# Altium schematic sheet LMS.SchDoc
size A4; SheetNumber: 1; SheetTotal: 1
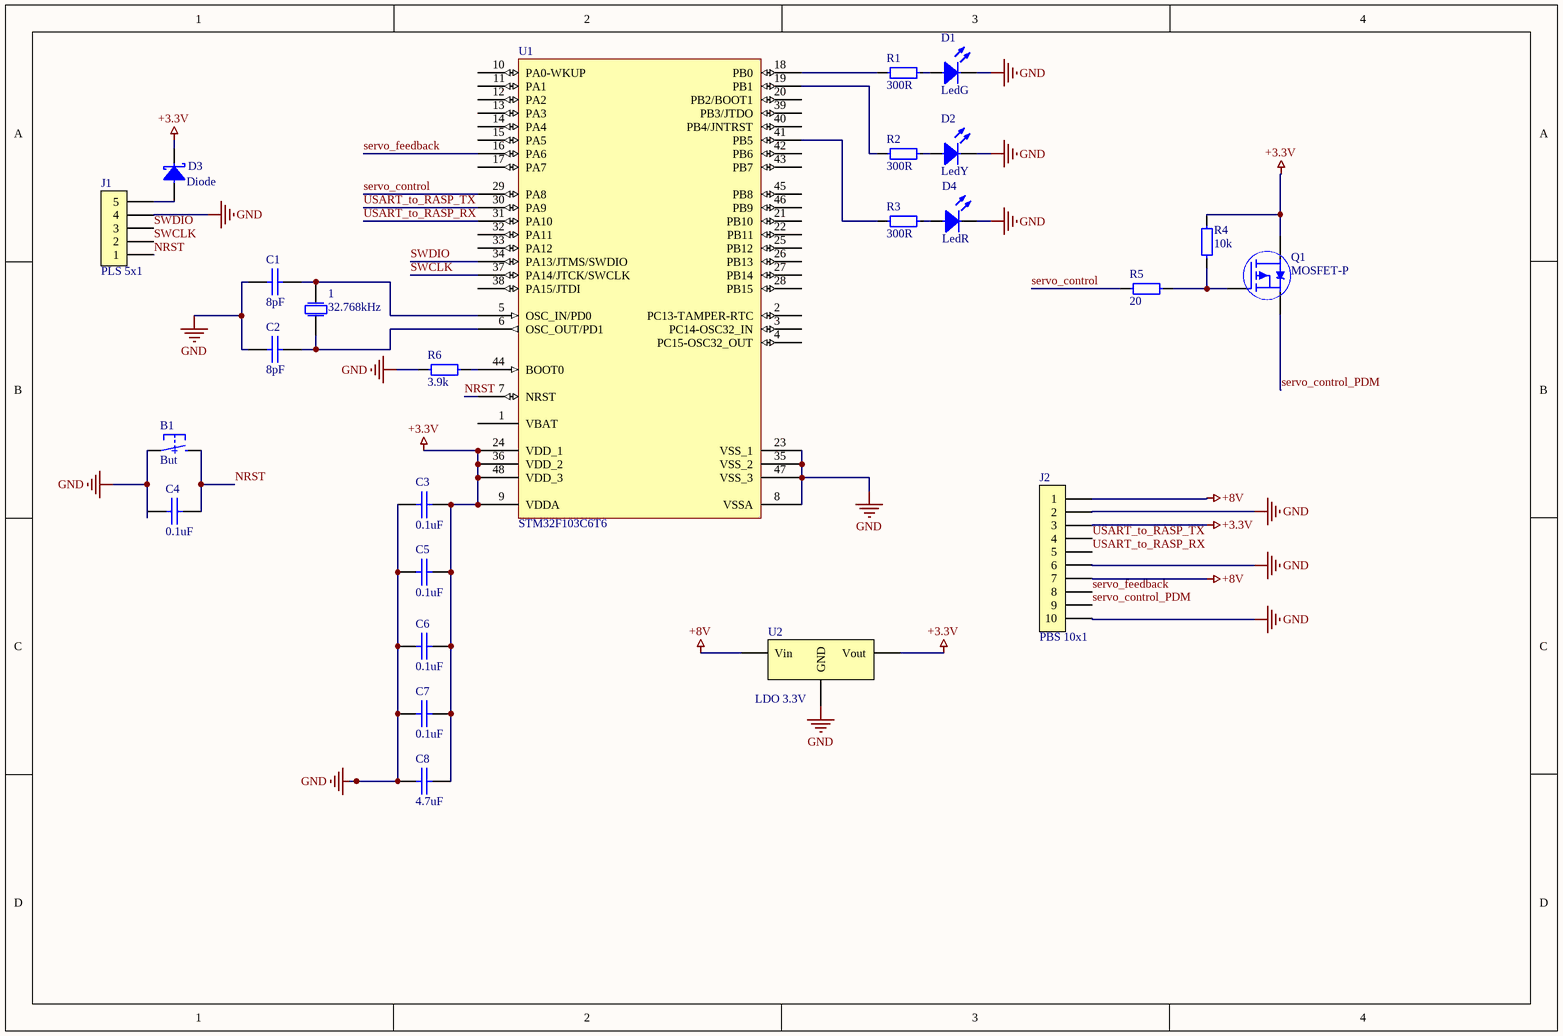
[diagram p0: LMS.SchDoc]

## Parts
1  32.768kHz  [Crystal ABM]
B1  But  [BUTTON 6x3.5]
C1  8pF  [0805 Capicator]
C2  8pF  [0805 Capicator]
C3  0.1uF  [0805 Capicator]
C4  0.1uF  [0805 Capicator]
C5  0.1uF  [0805 Capicator]
C6  0.1uF  [0805 Capicator]
C7  0.1uF  [0805 Capicator]
C8  4.7uF  [0805 Capicator]
D1  LedG  [0805 LED]
D2  LedY  [0805 LED]
D3  Diode  [SMA]
D4  LedR  [0805 LED]
J1  PLS 5x1  [PLS 5x1]
J2  PBS 10x1  [PBS10]
Q1  MOSFET-P  [SOT-23]
R1  300R  [0805 Resistor]
R2  300R  [0805 Resistor]
R3  300R  [0805 Resistor]
R4  10k  [0805 Resistor]
R5  20  [0805 Resistor]
R6  3.9k  [0805 Resistor]
U1  STM32F103C6T6  [LQFP48]
U2  LDO 3.3V  [SOT-223]

## Nets
+3.3V: C3.1 C5.1 C6.1 C7.1 C8.1 D3.2 J2.3 Q1.3(Drain) R4.2 U1.9(VDDA) U1.24(VDD_1) U1.36(VDD_2) U1.48(VDD_3) U2.2(Vout)
+8V: J2.1 J2.7 U2.3(Vin)
GND: B1.1 C1.1 C2.1 C3.2 C5.2 C6.2 C7.2 C8.2 D1.2 D2.2 D4.2 J1.4 J2.2 J2.6 J2.10 R6.1 U1.8(VSSA) U1.23(VSS_1) U1.35(VSS_2) U1.47(VSS_3) U2.1(GND)
NRST: B1.2 C4.2 J1.1 U1.7(NRST)
servo_control: R5.1 U1.29(PA8)
servo_control_PDM: J2.9 Q1.2(Source)
servo_feedback: J2.8 U1.16(PA6)
SWCLK: J1.2 U1.37(PA14/JTCK/SWCLK)
SWDIO: J1.3 U1.34(PA13/JTMS/SWDIO)
USART_to_RASP_RX: J2.5 U1.31(PA10)
USART_to_RASP_TX: J2.4 U1.30(PA9)
Net1_1: 1.1 C2.2 U1.6(OSC_OUT/PD1)
Net1_2: 1.2 C1.2 U1.5(OSC_IN/PD0)
NetD1_1: D1.1 R1.2
NetD2_1: D2.1 R2.2
NetD3_1: D3.1 J1.5
NetD4_1: D4.1 R3.2
NetQ1_1: Q1.1(Gate) R4.1 R5.2
NetR1_1: R1.1 U1.18(PB0)
NetR2_1: R2.1 U1.19(PB1)
NetR3_1: R3.1 U1.41(PB5)
NetR6_2: R6.2 U1.44(BOOT0)

Not connected (* = marked no-connect by the designer): C4 1; U1 1(VBAT) 2(PC13-TAMPER-RTC) 3(PC14-OSC32_IN) 4(PC15-OSC32_OUT) 10(PA0-WKUP) 11(PA1) 12(PA2) 13(PA3) 14(PA4) 15(PA5) 17(PA7) 20(PB2/BOOT1) 21(PB10) 22(PB11) 25(PB12) 26(PB13) 27(PB14) 28(PB15) 32(PA11) 33(PA12) 38(PA15/JTDI) 39(PB3/JTDO) 40(PB4/JNTRST) 42(PB6) 43(PB7) 45(PB8) 46(PB9)

## Library data of the parts
1 = Crystal 32.768kHz: 32.768kHz, SMD, 6 pF; Manufacturer: Seiko; Part Number: 9000417960; Type: Crystal; ComponentLink1Description: Chip&Dip; ComponentLink1URL: https://www.chipdip.ru/product/32.768-khz-smd-8mmx3.8mm-6-pf
B1 = Button 2 Conn: Button 2 Conn SMD; Part Number: L-KLS7-TS3608-5.0-180; Manufacturer: KLS electronic co ltd; Type: Button; ComponentLink1Description: Chip&Dip; ComponentLink1URL: https://www.chipdip.ru/product/kls7-ts3608-5.0-180-td-02xa
C1 C2 = Cap 8pF (0805)_1: 8pF NPO 50V, 5%, 0805; Manufacturer: Murata Manufacturing; Part Number: MLCC8.0pFNPO50V5%0805; Type: Capacitor; ComponentLink1Description: Chip&Dip; ComponentLink1URL: https://www.chipdip.ru/product0/180505270
C3-C7 = Cap 0.1uF (0805): 0.1uF X7R 25V 10% 0805; Manufacturer: Murata Manufacturing; Part Number: GRM21BR71E104KA01L; Type: Capacitor; ComponentLink1Description: Chip&Dip; ComponentLink1URL: https://www.chipdip.ru/product/grm21br71e104ka01l
C8 = Cap 4.7uF (0805): 4.7uF X5R 10% 25V 0805; Manufacturer: Murata Manufacturing; Part Number: GRM21BR61E475KA12L; Type: Capacitor; ComponentLink1Description: Chip&Dip; ComponentLink1URL: https://www.chipdip.ru/product/grm21br61e475ka12l
D1 = Led Green: Led Green SMD 1608, 120°, 525nM; Part Number: TO-1608BC-PG; Manufacturer: Taiwan Oasis Technology; Type: Diode; ComponentLink1Description: Chip&Dip; ComponentLink1URL: https://www.chipdip.ru/product/to-1608bc-pg
D2 = Led Yellow: SMD 1608, 247mcd, 120°, 592nM (High Bright Yellow); Part Number: TO-1608BC-MYF; Manufacturer: Taiwan Oasis Technology; Type: Diode; ComponentLink1Description: Chip&Dip; ComponentLink1URL: https://www.chipdip.ru/product/to-1608bc-myf
D3 = Diode Schottky (SMA): Diode Schottky 3A 40V; Part Number: B340A-E3/61T; Manufacturer: Vishay; Type: Diode; ComponentLink1Description: DataSheet; ComponentLink1URL: https://static.chipdip.ru/lib/652/DOC001652710.pdf; ComponentLink2Description: Chip&Dip; ComponentLink2URL: https://www.chipdip.ru/product/b340a-e3-61t-2
D4 = Led Red: SMD 1608, 112mcd, 120°, 630nM (Ultra Bright Red); Part Number: TO-1608BC-MRE; Manufacturer: Taiwan Oasis Technology; Type: Diode; ComponentLink1Description: Chip&Dip; ComponentLink1URL: https://www.chipdip.ru/product/to-1608bc-mre
J1 = Conn 5 (PLS): Header, 5-Pin
J2 = Conn 10 (PBS): Female; Part Number: DS1023-1*10S21; Manufacturer: Ningbo connfly electronic; Type: Connector; ComponentLink1Description: Chip&Dip; ComponentLink1URL: https://www.chipdip.ru/product/pbs-10
Q1 = MOSFET-P [IRLML]: P-Channel Power MOSFET 12V to 20V, Infineon; Part Number: IRLML2246TRPBF; Manufacturer: Infineon Technologies; Type: Transistor; ComponentLink1Description: Chip&Dip; ComponentLink1URL: https://www.chipdip.ru/product/irlml2246trpbf; ComponentLink2Description: DataSheet; ComponentLink2URL: http://www.farnell.com/datasheets/1911921.pdf
R1-R3 = Res 300R (0805): 0.125W 0805 300R, 1%; Part Number: RC0805FR-07300RL; Manufacturer: Taiwan; Type: Resistor; ComponentLink1Description: Chip&Dip; ComponentLink1URL: https://www.chipdip.ru/product0/9000079473
R4 R5 = Res 10k (0805): 0.125W 0805 10k, 1%; Part Number: RC0805FR-0710KL; Manufacturer: Taiwan; Type: Resistor; ComponentLink1Description: Chip&Dip; ComponentLink1URL: https://www.chipdip.ru/product0/9000079514
R6 = Res 1k (0805): 0.125W 0805 1k, 1%; Part Number: RC0805FR-071KL; Manufacturer: Taiwan; Type: Resistor; ComponentLink1Description: Chip&Dip; ComponentLink1URL: https://www.chipdip.ru/product0/9000079486
U1 = STM32F103C6T6: STM32 ARM-based 32-bit MCU with 32 Kbytes Flash, 48-pin LQFP, Industrial Temperature; Published: 30-May-2008; DatasheetVersion: rev6, Mar-2008; PackageVersion: Mar-2008; PackageReference: LQFP48; Publisher: Altium Limited; PackageDescription: 48-Pin Low-Profile Quad Flat Pack, 7 x 7 mm Body, 0.5 mm Pitch (LQFP48); ComponentLink1Description: Manufacturer Link; ComponentLink1URL: www.st.com/stm32; ComponentLink2Description: Datasheet; ComponentLink2URL: http://www.st.com/stonline/products/literature/ds/13587.pdf
U2 = LDO 3.3V [LD]: LDO Regulator Pos 3.3V 1.3A 4-Pin(3+Tab) SOT-223 T/R; Part Number: LD1117S33CTR; Manufacturer: STMicroelectronics; ComponentLink1Description: DataSheet; ComponentLink1URL: https://static.chipdip.ru/lib/292/DOC000292513.pdf; ComponentLink2Description: Chip&Dip; ComponentLink2URL: https://www.chipdip.ru/product/ld1117s33ctr-2